# EAGLE design led-rgb (EAGLE 9.2.2)
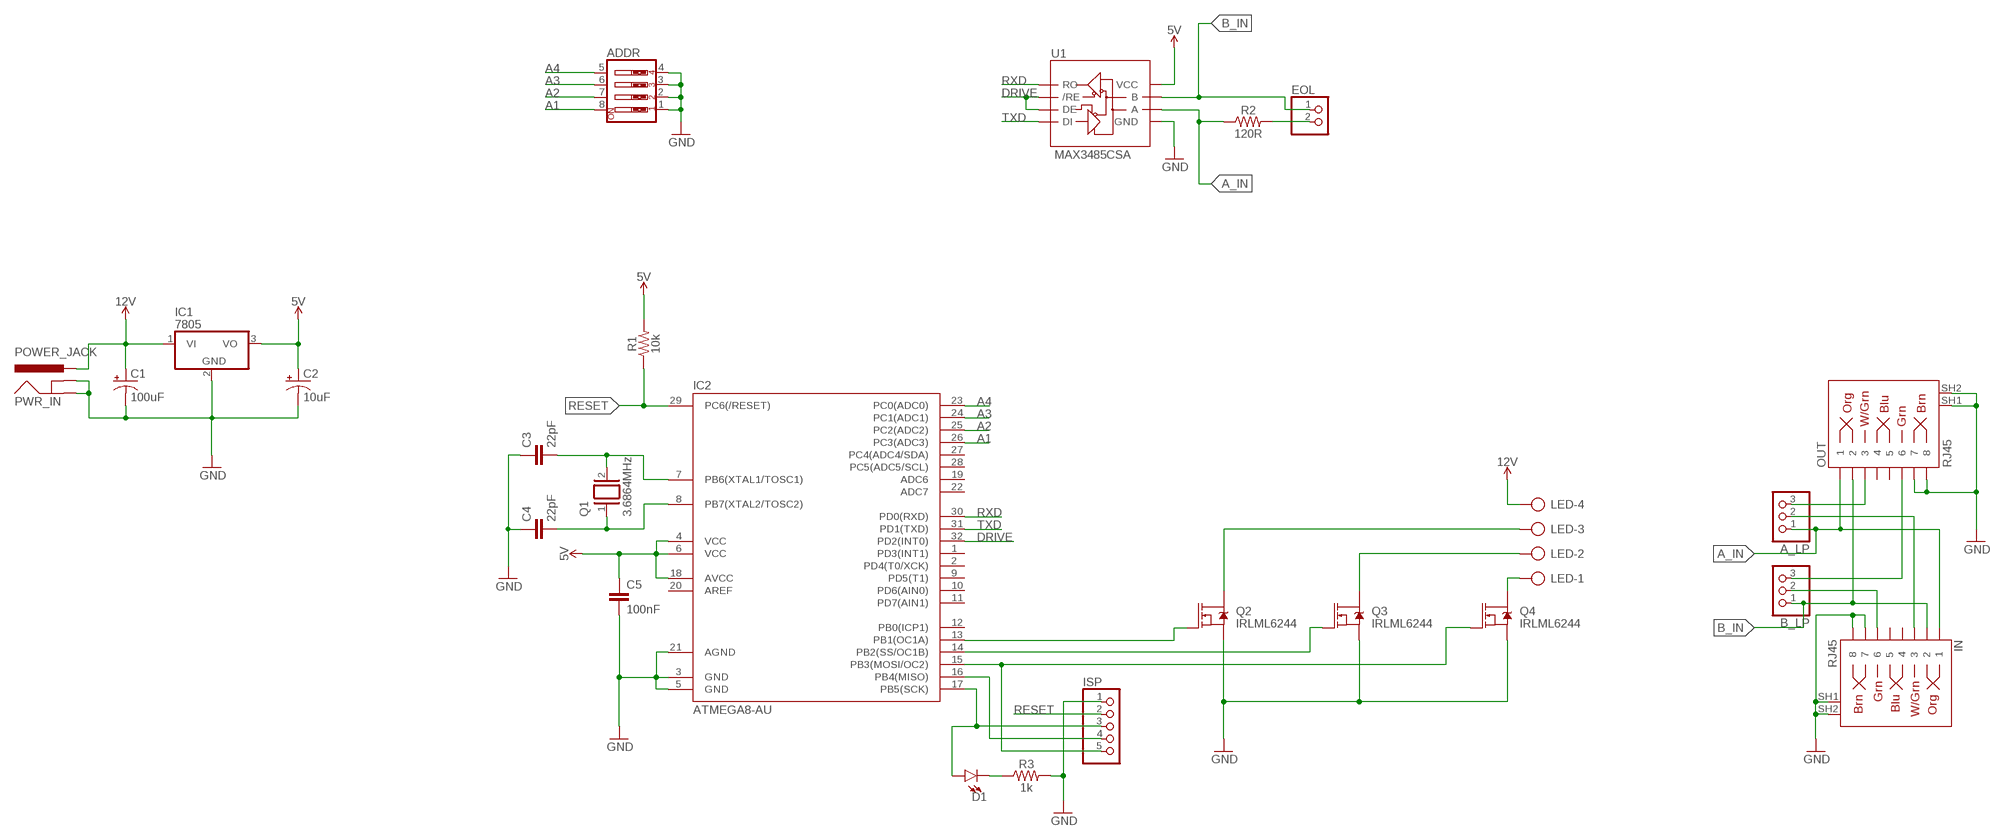
[diagram p0: schematic, sheet 1]

## Parts
A_LP  PINHD-1X3  [1X03]
ADDR  SW_DIP-4  [EDG-04]
B_LP  PINHD-1X3  [1X03]
C1  100uF  100UF-POLAR-RADIAL-2.5MM-25V-20%  [CPOL-RADIAL-2.5MM-6.5MM]
C2  10uF  10UF-POLAR-RADIAL-2.5MM-25V-20%  [CPOL-RADIAL-2.5MM-5MM]
C3  22pF  C-EUC0805  [C0805]
C4  22pF  C-EUC0805  [C0805]
C5  100nF  C-EUC0603  [C0603]
D1  LED3MM  [LED_3MM]
EOL  PINHD-1X2  [1X02]
IC1  7805  7812TV  [TO220V]
IC2  ATMEGA8-AU  [TQFP32-08]
IN  RJ45  RJ45-8  [RJ45-8]
ISP  PINHD-1X5  [1X05]
LED  AK300/4  [AK300/4]
OUT  RJ45  RJ45-8  [RJ45-8]
PWR_IN  POWER_JACK  [POWER_JACK_PTH]
Q1  3.6864MHz  XTAL/S  [QS]
Q2  IRLML6244  MOSFET-NCH-AO3404A  [SOT23-3]
Q3  IRLML6244  MOSFET-NCH-AO3404A  [SOT23-3]
Q4  IRLML6244  MOSFET-NCH-AO3404A  [SOT23-3]
R1  10k  10KOHM-0603-1/10W-1%  [0603]
R2  120R  RESISTOR0805  [0805]
R3  1k  1KOHM-0603-1/10W-1%  [0603]
U1  MAX3485CSA  RS485SOIC  [SO08]

## Nets
5V: C2.1(+) C5.1 IC1.3(VO) IC2.4(VCC) IC2.6(VCC) IC2.18(AVCC) R1.2 U1.8(VCC)
12V: C1.1(+) IC1.1(VI) LED.4 PWR_IN.PWR
A1: ADDR.8 IC2.26(PC3(ADC3))
A2: ADDR.7 IC2.25(PC2(ADC2))
A3: ADDR.6 IC2.24(PC1(ADC1))
A4: ADDR.5 IC2.23(PC0(ADC0))
A-LOOP: A_LP.2 IN.3
A-LOOP-BACK: A_LP.3 OUT.3
A_IN: A_LP.1 IN.1 OUT.1 R2.1 U1.6(A)
B-5V-MOSI: IC2.15(PB3(MOSI/OC2)) ISP.5 Q4.1(G)
B-12V: LED.1 Q4.3(D)
B-LOOP: B_LP.2 IN.6
B-LOOP-BACK: B_LP.3 OUT.6
B_IN: B_LP.1 EOL.1 IN.2 OUT.2 U1.7(B)
DRIVE: IC2.32(PD2(INT0)) U1.2(/RE) U1.3(DE)
EOL1: EOL.2 R2.2
G-5V: IC2.13(PB1(OC1A)) Q2.1(G)
G-12V: LED.3 Q2.3(D)
GND: ADDR.1 ADDR.2 ADDR.3 ADDR.4 C1.2(-) C2.2(-) C3.1 C4.1 C5.2 IC1.2(GND) IC2.3(GND) IC2.5(GND) IC2.21(AGND) IN.7 IN.8 IN.SH1 IN.SH2 ISP.1 OUT.7 OUT.8 OUT.SH1 OUT.SH2 PWR_IN.GND PWR_IN.GNDBREAK Q2.2(S) Q3.2(S) Q4.2(S) R3.2 U1.5(GND)
MISO: IC2.16(PB4(MISO)) ISP.4
N$2: D1.K(C) R3.1
R-5V: IC2.14(PB2(SS/OC1B)) Q3.1(G)
R-12V: LED.2 Q3.3(D)
RESET: IC2.29(PC6(/RESET)) ISP.2 R1.1
RXD: IC2.30(PD0(RXD)) U1.1(RO)
SCK: D1.A IC2.17(PB5(SCK)) ISP.3
TXD: IC2.31(PD1(TXD)) U1.4(DI)
XTAL1: C3.2 IC2.7(PB6(XTAL1/TOSC1)) Q1.2
XTAL2: C4.2 IC2.8(PB7(XTAL2/TOSC2)) Q1.1
Unconnected: IC2.1(PD3(INT1)) IC2.2(PD4(T0/XCK)) IC2.9(PD5(T1)) IC2.10(PD6(AIN0)) IC2.11(PD7(AIN1)) IC2.12(PB0(ICP1)) IC2.19(ADC6) IC2.20(AREF) IC2.22(ADC7) IC2.27(PC4(ADC4/SDA)) IC2.28(PC5(ADC5/SCL)) IN.4 IN.5 OUT.4 OUT.5

## Library data of the parts
A_LP B_LP = pinhead:PINHD-1X3: PIN HEADER; OC_NEWARK: unknown
ADDR = special:SW_DIP-4: DIP SWITCH; OC_NEWARK: unknown
C1 = SparkFun-Capacitors:100UF-POLAR: 100µF polarized capacitors A capacitor is a passive two-terminal electrical component used to store electrical energy temporarily in an electric field.; OC_NEWARK: unknown; PROD_ID: CAP-08439
C2 = SparkFun-Capacitors:10UF-POLAR: 10.0µF polarized capacitors A capacitor is a passive two-terminal electrical component used to store electrical energy temporarily in an electric field.; OC_NEWARK: unknown; PROD_ID: CAP-08440
C3 C4 = resistor:C-EU: CAPACITOR, European symbol; OC_NEWARK: unknown
C5 = resistor:C-EU: CAPACITOR, European symbol; MPN: C0603X5R1C104K030BC; OC_NEWARK: 04X3191
D1 = SparkFun-LED:LED: LED (Generic) Standard schematic elements and footprints for 5mm, 3mm, 1206, and 0603 sized LEDs. Generic LEDs with no color specified.; PROD_ID: DIO-08794
EOL = pinhead:PINHD-1X2: PIN HEADER; MF: TYCO ELECTRONICS; MPN: V23026D1021B201 *X020; OC_NEWARK: 08H5615
IC1 = linear:78*: Positive VOLTAGE REGULATOR Source: http://cache.national.com/ds/LM/LM78L05.pdf http://www.fairchildsemi.com/ds/LM/LM7805.pdf; OC_NEWARK: unknown
IC2 = atmega8:ATMEGA8; OC_NEWARK: unknown
IN OUT = SparkFun-Connectors-MyRJ:RJ45-8: RJ45 Jack - 8 pin Simple RJ45, 8-pin connection. Commonly used for Cat5, Cat5e, and Cat6 Ethernet cables. Here is the connector we sell at SparkFun: RJ45 8-Pin Connector <https://www.sparkfun.com/products/643> (PRT-00643) Datasheet <https://cdn.sparkfun.com/datasheets/Prototyping/04908.pdf> It is used on this SparkFun product: SparkFun RJ45 Breakout <https://www.sparkfun.com/products/716> (BOB-00716) Note, you may also be interested in the "MAGJACK" version of this. It is basically a RJ45 connector, but also has some status LEDs built into the connector housing. You can check that out in this library at the device named "MAGJACK.dev" and see these products online: RJ45 Ethernet MagJack-Compatible <https://www.sparkfun.com/products/8534> (PRT-08534) SparkFun RJ45 MagJack Breakout <https://www.sparkfun.com/products/13021> (BOB-13021); OC_NEWARK: unknown; PROD_ID: CONN-08506; SF_ID: PRT-00643
ISP = pinhead:PINHD-1X5: PIN HEADER; OC_NEWARK: unknown
LED = con-ptr500:AK300/4: CONNECTOR; OC_FARNELL: unknown; OC_NEWARK: unknown
PWR_IN = SparkFun-Connectors:POWER_JACK: Power Jack Connector This is the standard 5.5mm barrel jack for power. The PTH is the most common, proven, reliable, footprint. The Slot footprint only works if the mill layer is transmitted to the PCB fab house so be warned. Here are the connectors we sell at SparkFun: DC Barrel Power Jack/Connector <https://www.sparkfun.com/products/119> (PRT-00119) DC Barrel Power Jack/Connector (SMD) <https://www.sparkfun.com/products/12748> (PRT-12748) DC Barrel Jack Adapter - Breadboard Compatible <https://www.sparkfun.com/products/10811> (PRT-10811) It is used on this SparkFun product (and many, many others): SparkFun RedBoard - Programmed with Arduino <https://www.sparkfun.com/products/12757> (DEV-12757) Also, if you need a mating power supply or connector, please check these out: Wall Adapter Power Supply - 9VDC 650mA <https://www.sparkfun.com/products/298> (TOL-00298) DC Barrel Jack Adapter - Male <https://www.sparkfun.com/products/10287> (PRT-10287); OC_NEWARK: unknown; PROD_ID: CONN-08197
Q1 = special:XTAL/S: CRYSTAL; OC_NEWARK: unknown
Q2-Q4 = SparkFun-DiscreteSemi:MOSFET-NCH: N-channel MOSFETs Voltage controlled devices that allow control of high current outputs. SparkFun Products: SparkFun OpenScale <https://www.sparkfun.com/products/13261> SparkFun Digital Sandbox <https://www.sparkfun.com/products/12651> SparkFun Monster Moto Shield <https://www.sparkfun.com/products/10182> SparkFun MOSFET Power Controller <https://www.sparkfun.com/products/11214>; OC_NEWARK: unknown; PROD_ID: TRANS-12988; VALUE: 5.8A/30V/35mΩ
R1 = SparkFun-Resistors:10KOHM: 10kΩ resistor A resistor is a passive two-terminal electrical component that implements electrical resistance as a circuit element. Resistors act to reduce current flow, and, at the same time, act to lower voltage levels within circuits. - Wikipedia; OC_NEWARK: unknown; PROD_ID: RES-00824
R2 = SparkFun-Resistors:RESISTOR: Generic Resistor Package; OC_NEWARK: unknown
R3 = SparkFun-Resistors:1KOHM: 1kΩ resistor A resistor is a passive two-terminal electrical component that implements electrical resistance as a circuit element. Resistors act to reduce current flow, and, at the same time, act to lower voltage levels within circuits. - Wikipedia; PROD_ID: RES-07856
U1 = SparkFun-IC-Comms:RS485: RS-485 Transceiver SP3485 Series 8 Pin NSOIC 3.3 V Low Power Half Duplex RS-485 Transceiver MAX3485 compatible Datasheet <http://www.sparkfun.com/datasheets/Components/General/sp3485CN-LTR.pdf> SparkFun Products SparkFun Transceiver Breakout - RS-485 <https://www.sparkfun.com/products/10124> (BOB-10124) SparkFun USB to RS-485 Converter <https://www.sparkfun.com/products/9822> (BOB-09822); OC_NEWARK: unknown; PROD_ID: IC-09388

## Board
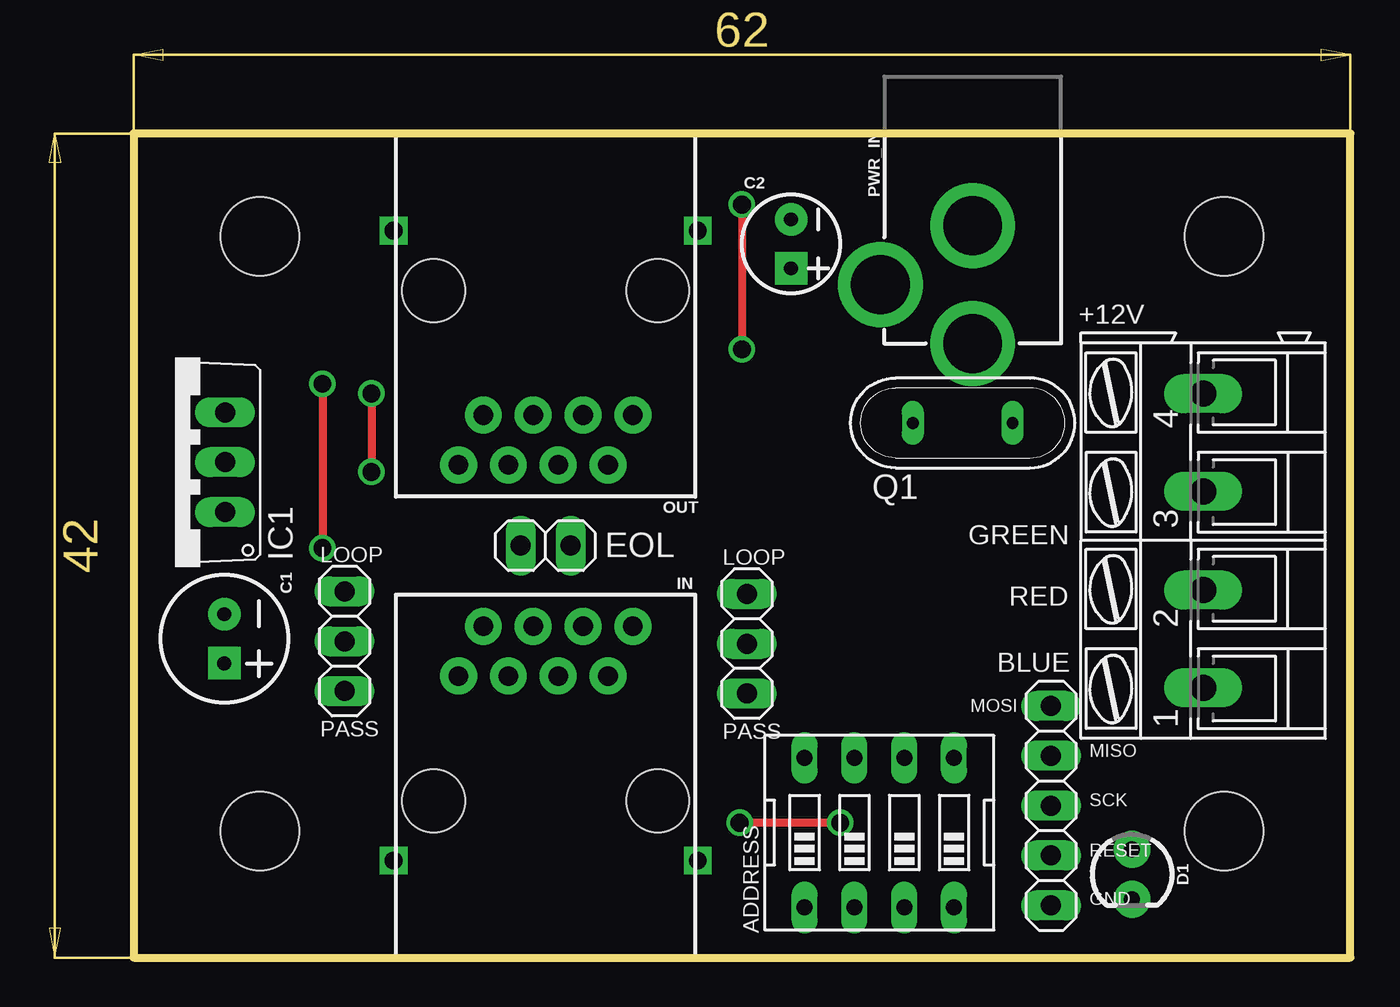
[diagram p1: board, top side]
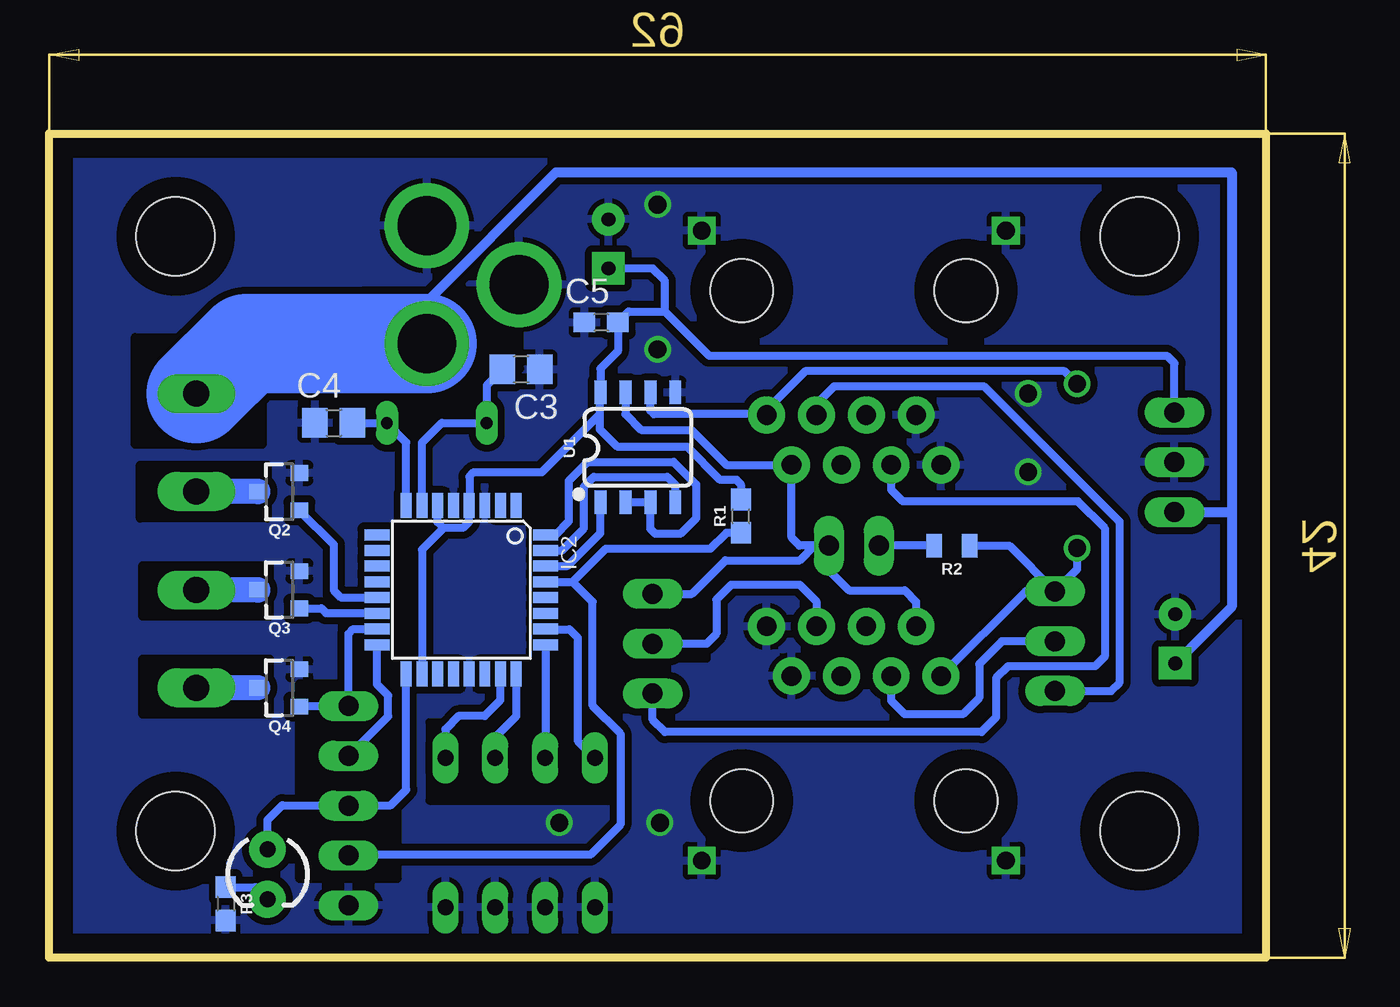
[diagram p2: board, bottom side, seen from below]

Size 62 x 42 mm. Coordinates in mm from the lower left corner, seen from the top.
Outline: 0,0 62,0 62,42 0,42 0,0
Copper layers (1*16): Top 0.035mm / dielectric 1.5mm / Bottom 0.035mm
Design rules "default *": minimum track width 16mil, minimum drill 0.35mm, track to track 14mil, track to pad 12mil, pad to pad 6mil, via to via 6mil, smd to smd 6mil, copper to edge 40mil, drill to drill 6mil, minimum pad ring 10mil, minimum via ring 8mil, stop-mask expansion 4mil, vias tented up to drill 0mil, thermal gap 10mil
Holes 4 mm at 6.45,6.45 6.45,36.75 55.55,36.75 55.55,6.45
bKeepout: area 28,16 to 34,20
bRestrict: area 33.4,8 to 42.6,12; area 44.2,4 to 49.2,14; area 28.5,15.2 to 33.9,20; area 50.8,12.4 to 57.2,15.2; area 50.8,17.4 to 57.2,20; area 50.9,22.4 to 57.4,25.1; area 51.1,26.1 to 57.6,31.6; area 38,30 to 46,34

### Footprints (pad centres in the part's own frame; a part is rotated, then mirrored left to right if it is on the bottom)
1X03 = drill 1.016 long: 1 -2.54,0; 2 0,0; 3 2.54,0
EDG-04 = drill 0.813 long: 1 -3.81,-3.81; 2 -1.27,-3.81; 3 1.27,-3.81; 4 3.81,-3.81; 5 3.81,3.81; 6 1.27,3.81; 7 -1.27,3.81; 8 -3.81,3.81
CPOL-RADIAL-2.5MM-6.5MM = drill 0.7 pad 1.651 square: 1 1.25,0 | drill 0.7 pad 1.651: 2 -1.25,0
CPOL-RADIAL-2.5MM-5MM = drill 0.7 pad 1.651 square: 1 1.25,0 | drill 0.7 pad 1.651: 2 -1.25,0
C0805 = smd 1.3 x 1.5: 1 -0.95,0; 2 0.95,0
C0603 = smd 1.1 x 1: 1 -0.85,0; 2 0.85,0
LED_3MM = drill 0.813 pad 1.88: A -1.27,0; K 1.27,0
1X02 = drill 1.016 long: 1 -1.27,0; 2 1.27,0
TO220V = drill 1.016 long: 1 -2.54,-2.54; 2 0,-2.54; 3 2.54,-2.54
TQFP32-08 = smd 1.27 x 0.559: 1 -4.293,2.8; 2 -4.293,2; 3 -4.293,1.2; 4 -4.293,0.4; 5 -4.293,-0.4; 6 -4.293,-1.2; 7 -4.293,-2; 8 -4.293,-2.8; 17 4.293,-2.8; 18 4.293,-2; 19 4.293,-1.2; 20 4.293,-0.4; 21 4.293,0.4; 22 4.293,1.2; 23 4.293,2; 24 4.293,2.8 | smd 0.559 x 1.27: 9 -2.8,-4.293; 10 -2,-4.293; 11 -1.2,-4.293; 12 -0.4,-4.293; 13 0.4,-4.293; 14 1.2,-4.293; 15 2,-4.293; 16 2.8,-4.293; 25 2.8,4.293; 26 2,4.293; 27 1.2,4.293; 28 0.4,4.293; 29 -0.4,4.293; 30 -1.2,4.293; 31 -2,4.293; 32 -2.8,4.293
RJ45-8 = drill 1 pad 1.88: 1 -4.445,6.35; 2 -3.175,8.89; 3 -1.905,6.35; 4 -0.635,8.89; 5 0.635,6.35; 6 1.905,8.89; 7 3.175,6.35; 8 4.445,8.89 | drill 0.9 square: SH1 -7.75,-3.05; SH2 7.75,-3.05 | hole 3.2: -5.715,0; 5.715,0
1X05 = drill 1.016 long: 1 -5.08,0; 2 -2.54,0; 3 0,0; 4 2.54,0; 5 5.08,0
AK300/4 = drill 1.321 long: 1 -7.493,0; 2 -2.515,0; 3 2.515,0; 4 7.493,0
POWER_JACK_PTH = drill 2.997 pad 4.318: GND 0,7.7; GNDBREAK 4.7,10.7; PWR 0,13.7
QS = drill 0.61 long: 1 -2.54,0; 2 2.54,0
SOT23-3 = smd 0.8 x 0.9: 1 -0.95,-1; 2 0.95,-1; 3 0,1.1
0603 = smd 1.1 x 1: 1 -0.85,0; 2 0.85,0
0805 = smd 0.8 x 1.2: 1 -0.9,0; 2 0.9,0
SO08 = smd 0.6 x 1.2: 1 -1.905,-2.8; 2 -0.635,-2.8; 3 0.635,-2.8; 4 1.905,-2.8; 5 1.905,2.8; 6 0.635,2.8; 7 -0.635,2.8; 8 -1.905,2.8

### Placement (x,y rotation side)
A_LP  10.75,16.12 270 top
ADDR  38,6.38 0 top
B_LP  31.25,16 270 top
C1  4.62,16.25 270 top
C2  33.5,36.38 270 top
C3  37.95,29.98 180 bottom
C4  47.5,27.25 0 bottom
C5  33.88,32.38 180 bottom
D1  50.88,4.25 270 top
EOL  21,21 180 top
IC1  2.12,25.25 90 top
IC2  41,18.75 270 bottom
IN  21,8 0 top
ISP  46.75,7.75 90 top
LED  54.5,21.25 90 top
OUT  21,34 180 top
PWR_IN  42.75,45 180 top
Q1  42.25,27.25 180 top
Q2  50.25,23.75 90 bottom
Q3  50.25,18.75 90 bottom
Q4  50.25,13.75 90 bottom
R1  26.75,22.5 90 bottom
R2  16,21 180 bottom
R3  53,2.75 270 bottom
U1  32,26 0 bottom

### Tracks (layer width: path | path; a pad name or v marks a point on that pad's centre or on a via)
5V
  Bottom 0.406: IC1.3 4.67,30.29 5.06,30.68 28.38,30.68 30.62,32.93 | 33.94,27.68 33.94,28.76 U1.8 33.91,30.02 33.02,30.9 C5.1 32.47,32.93 30.62,32.93 | 33.94,27.68 33.94,26.93 33.03,26.02 29.48,26.02 27.81,24.35 26.97,24.35 26.75,24.12 R1.2 | IC2.6 42.21,23.03 42.21,22.2 42.19,22.2 41.89,21.9 | 41.89,21.9 40.91,21.9 40.61,22.2 40.61,23.03 IC2.4 40.59,23.05 40.59,24.51 40.36,24.74 36.89,24.74 33.94,27.68 | 41.89,21.9 43,20.79 IC2.18 | C2.1 31.25,35.12 30.62,34.5 30.62,32.93
12V
  Bottom 0.508: 1.75,22.71 1.75,40.02 36.17,40.02 42.75,33.44 PWR_IN.PWR | IC1.1 1.75,22.71 | 1.75,22.71 1.75,17.88 C1.1
  Bottom 5.08: PWR_IN.PWR 51.94,31.3 LED.4
A1
  Bottom 0.406: IC2.26 36.7,16.74 35.49,16.74 35.06,16.32 35.06,11.06 ADDR.8
A2
  Bottom 0.406: IC2.25 36.71,10.21 ADDR.7
A3
  Bottom 0.406: IC2.24 38.2,12.3 39.27,11.23 ADDR.6
A4
  Bottom 0.406: ADDR.5 41.81,11.65 41.14,12.31 39.81,12.31 39.01,13.11 39.01,14.45 IC2.23
A-LOOP
  Bottom 0.406: A_LP.2 13.46,16.12 14.61,14.97 14.61,13.25 15.46,12.4 18.4,12.4 19.09,13.1 IN.3
A-LOOP-BACK
  Bottom 0.406: A_LP.3 7.9,13.59 7.46,14.03 7.46,22.21 14.38,29.12 22,29.12 22.91,28.22 OUT.3
A_IN  (via drill 0.9)
  Top 0.406: v9.62,29.25 v9.62,20.88
  Bottom 0.406: R2.1 13.09,21 A_LP.1 | U1.6 31.36,27.86 31.19,27.69 25.49,27.69 OUT.1 25.45,27.91 23.47,29.89 10.26,29.89 v9.62,29.25 | v9.62,20.88 9.62,19.79 A_LP.1 | A_LP.1 12.24,18.66 IN.1
B-5V-MOSI
  Bottom 0.406: IC2.15 46.5,16.75 46.75,16.5 ISP.5 46.78,12.8 Q4.1
B-12V
  Bottom 1.27: Q4.3 LED.1
B-LOOP
  Bottom 0.406: B_LP.2 28.5,16 28,16.5 28,18.25 27.25,19 23.75,19 22.91,18.16 IN.6
B-LOOP-BACK
  Bottom 0.406: B_LP.3 31.25,12.13 30.62,11.5 14.5,11.5 13.75,12.25 13.75,14.25 13.14,14.86 8.71,14.86 8.22,15.35 8.22,21.89 9.58,23.25 18.5,23.25 19.09,23.84 OUT.6
B_IN
  Bottom 0.406: EOL.1 23.77,21 24.18,21.41 OUT.2 27.49,25.11 29.28,26.9 31.83,26.9 32.63,27.7 U1.7 | B_LP.1 29.25,18.54 27.54,20.25 23.75,20.25 23,21 EOL.1 | EOL.1 22.25,21 22.25,19.71 21.26,18.72 18.4,18.72 17.82,18.14 IN.2
DRIVE
  Bottom 0.406: IC2.32 36.21,21.55 35.51,22.25 35.51,24.32 34.57,25.26 30.18,25.26 29.04,24.11 29.04,22.39 29.84,21.59 31.11,21.59 31.36,21.85 U1.3 U1.2
EOL1
  Bottom 0.406: R2.2 EOL.2
G-5V
  Bottom 0.406: Q2.1 47.5,21.05 47.5,18.73 47.14,18.36 45.3,18.36 IC2.13
G-12V
  Bottom 1.27: Q2.3 51.37,23.77 LED.3
GND  (via drill 0.9)
  Top 0.406: v31,38.38 v31,31 | v36,6.88 v30.88,6.88 | v12.12,28.75 v12.12,24.75
  pour Bottom: 0,42 0,0 62,0 62,42
MISO
  Bottom 0.406: ISP.4 46.73,10.29 44.72,12.3 44.72,13.36 45.29,13.93 IC2.16
N$2
  Bottom 0.406: R3.1 51.49,3.6 D1.K
R-5V
  Bottom 0.406: Q3.1 48.12,17.8 47.89,17.56 45.3,17.56 IC2.14
R-12V
  Bottom 1.27: Q3.3 51.37,18.73 LED.2
RESET
  Bottom 0.406: ISP.2 46.71,5.25 34.42,5.25 32.9,6.78 32.9,11.43 34.3,12.83 34.3,18.13 35.32,19.15 | IC2.29 35.32,19.15 | R1.1 27.5,21.65 28.32,20.83 33.64,20.83 35.32,19.15
RXD
  Bottom 0.406: IC2.30 36.7,19.96 35.58,19.96 33.91,21.64 U1.1
SCK
  Bottom 0.406: ISP.3 46.73,7.77 | 46.73,7.77 44.59,7.77 43.8,8.56 IC2.17 | D1.A 50.88,7.02 50.12,7.77 46.73,7.77
TXD
  Bottom 0.406: IC2.31 36.7,20.76 35.86,20.76 34.75,21.88 34.75,24 34.25,24.5 30.5,24.5 30.09,24.09 U1.4
XTAL1
  Bottom 0.406: IC2.7 43,26.25 42,27.25 Q1.2 39.71,29.16 C3.2
XTAL2
  Bottom 0.406: IC2.8 43.8,26.26 Q1.1 C4.2

### Text on the board
tNames: +12V | GREEN | LOOP | LOOP | RED | BLUE | MOSI | PASS | PASS | MISO | SCK | RESET | GND | ADDRESS